# Altium schematic sheet ETH_microSD.SchDoc
size B; Organization: Altium Limited; Address1: L3, 12a Rodborough Rd; Address2: Frenchs Forest; Address3: NSW; Address4: Australia 2086
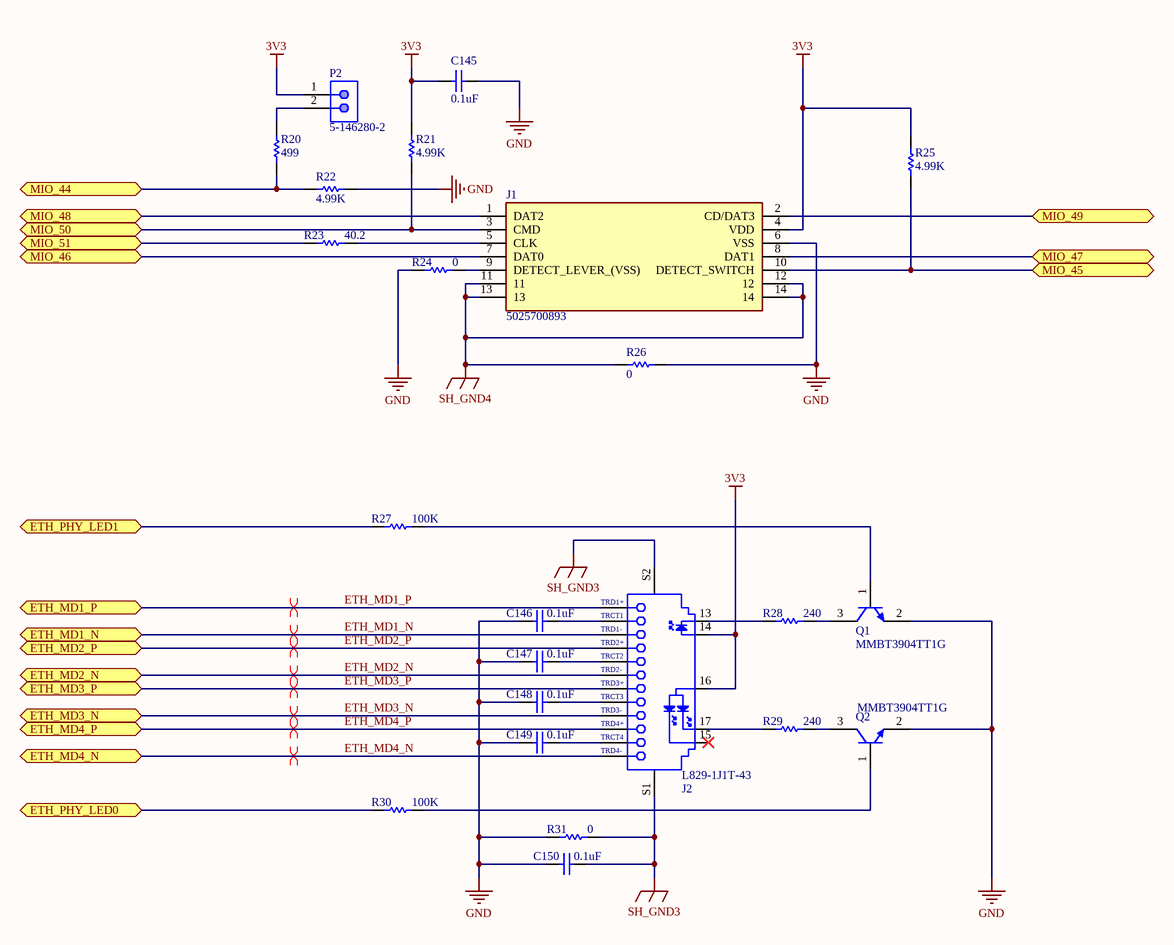
[diagram p0: ETH_microSD.SchDoc]

## Parts
C145  0.1uF  [CAPC0201(0603)33_N]
C146  0.1uF  [CAPC0201(0603)33_N]
C147  0.1uF  [CAPC0201(0603)33_N]
C148  0.1uF  [CAPC0201(0603)33_N]
C149  0.1uF  [CAPC0201(0603)33_N]
C150  0.1uF  [CAPC0201(0603)33_N]
J1  5025700893  [5025700893]
J2  L829-1J1T-43  [BELS-L829-1J1T-43_V]
P2  5-146280-2  [TECO-5-146280-2_V]
Q1  MMBT3904TT1G  [ONSC-SC-75-3-463-01_V]
Q2  MMBT3904TT1G  [ONSC-SC-75-3-463-01_V]
R20  499  [RESC0402(1005)_N]
R21  4.99K  [RESC0402(1005)_N]
R22  4.99K  [RESC0402(1005)_N]
R23  40.2  [RESC0402(1005)_N]
R24  0  [RESC0402(1005)_N]
R25  4.99K  [RESC0402(1005)_N]
R26  0  [RESC0402(1005)_N]
R27  100K  [RESC0402(1005)_N]
R28  240  [RESC0402(1005)_N]
R29  240  [RESC0402(1005)_N]
R30  100K  [RESC0402(1005)_N]
R31  0  [RESC0402(1005)_N]

## Ports
ETH_MD1_N (bidir), ETH_MD1_P (bidir), ETH_MD2_N (bidir), ETH_MD2_P (bidir), ETH_MD3_N (bidir), ETH_MD3_P (bidir), ETH_MD4_N (bidir), ETH_MD4_P (bidir), ETH_PHY_LED0 (bidir), ETH_PHY_LED1 (bidir), MIO_44 (bidir), MIO_45 (bidir), MIO_46 (bidir), MIO_47 (bidir), MIO_48 (bidir), MIO_49 (bidir), MIO_50 (bidir), MIO_51 (bidir)

## Nets
3V3: C145.1 J1.4(VDD) J2.14 J2.16 P2.1 R21.2 R25.2
GND: C145.2 C146.1 C147.1 C148.1 C149.1 C150.1 J1.6(VSS) Q1.2(E) Q2.2(E) R22.2 R24.1 R26.2 R31.1
SH_GND3: C150.2 J2.S1 J2.S2 R31.2
SH_GND4: J1.11 J1.12 J1.13 J1.14 R26.1
ETH_MD1_N: J2.3(TRD1-) ; port ETH_MD1_N
ETH_MD1_P: J2.1(TRD1+) ; port ETH_MD1_P
ETH_MD2_N: J2.6(TRD2-) ; port ETH_MD2_N
ETH_MD2_P: J2.4(TRD2+) ; port ETH_MD2_P
ETH_MD3_N: J2.9(TRD3-) ; port ETH_MD3_N
ETH_MD3_P: J2.7(TRD3+) ; port ETH_MD3_P
ETH_MD4_N: J2.12(TRD4-) ; port ETH_MD4_N
ETH_MD4_P: J2.10(TRD4+) ; port ETH_MD4_P
ETH_PHY_LED0: R30.1 ; port ETH_PHY_LED0
ETH_PHY_LED1: R27.1 ; port ETH_PHY_LED1
MIO_44: R20.1 R22.1 ; port MIO_44
MIO_45: J1.10(DETECT_SWITCH) R25.1 ; port MIO_45
MIO_46: J1.7(DAT0) ; port MIO_46
MIO_47: J1.8(DAT1) ; port MIO_47
MIO_48: J1.1(DAT2) ; port MIO_48
MIO_49: J1.2(CD/DAT3) ; port MIO_49
MIO_50: J1.3(CMD) R21.1 ; port MIO_50
MIO_51: R23.1 ; port MIO_51
NetC146_2: C146.2 J2.2(TRCT1)
NetC147_2: C147.2 J2.5(TRCT2)
NetC148_2: C148.2 J2.8(TRCT3)
NetC149_2: C149.2 J2.11(TRCT4)
NetJ1_5: J1.5(CLK) R23.2
NetJ1_9: J1.9(DETECT_LEVER_(VSS)) R24.2
NetJ2_13: J2.13 R28.1
NetJ2_17: J2.17 R29.1
NetP2_2: P2.2 R20.2
NetQ1_1: Q1.1(B) R27.2
NetQ1_3: Q1.3(C) R28.2
NetQ2_1: Q2.1(B) R30.2
NetQ2_3: Q2.3(C) R29.2

Not connected (* = marked no-connect by the designer): J2 15*

## Layout directives
differential pair: ETH_MD1_N, ETH_MD1_P, ETH_MD2_N, ETH_MD2_P, ETH_MD3_N, ETH_MD3_P, ETH_MD4_N, ETH_MD4_P

## Notes on the sheet
- Title
- Size:
- Date:
- B
- Number:
- Time:
- Revision:
- Sheet
- of
- File:

## Library data of the parts
C145-C150 = CAP_0201
J1 = 5025700893: Connector; Manufacturer_Name: Molex; Datasheet Link: https://www.molex.com/pdm_docs/sd/5025700893_sd.pdf; Height: 1mm; Manufacturer_Part_Number: 5025700893
J2 = CMP-1715-00001-1: Gigabit MagJack(R) Ultra Low Profile, 10/100/1000 Base-T, 19-Pin THD, RoHS, Tray; Width: 24.13 mm; RoHSCompliant: True; PartNumber: L829-1J1T-43; Case/Package: Metal; Mount: Through Hole; ComponentLink1Description: Manufacturer URL; Height: 11.3 mm; Package Quantity: 60; Packaging: Tray; Length: 17.78 mm; PackageDescription: 19-Pin Through Hole Device, Body 23.94 x 17.58 mm, Pitch 2.03 mm; ComponentLink2URL: http://belfuse.com/pdfs/L829-1J1T-43.pdf; ComponentLink1URL: http://belfuse.com/ethernet/; Mounting Technology: Through Hole; DatasheetVersion: Rev. G; Pins: 8; ComponentLink2Description: Datasheet
P2 = CMP-2000-07492-1: Male Header, Pitch 2.54 mm, 1 x 2 Position, Height 8.21 mm, Tail Length 3.05 mm, -65 to 105 degC, RoHS, Bulk; Manufacturer: TE Connectivity; Mating Connector Lock: No(Without); Number of Positions: 2; Pitch: 2.54mm; PCB Mounting Orientation: Vertical; Keyed: No; Case\/Package: 100; Mating Post Length: 0.23inch; High Temperature Housing: Yes; Max Current Rating: 5A; PCB Thickness: 0.063inch; PCB Mount Retention: Without; Approvals: CSA; Current Rating: 3A; Radiation Hardening: No; Length: 4.67mm; Contact Mating Length: 0.23inch; Connector Type: Header; Number of Rows: 1; Termination Post Length: 0.12inch; Board Standoff: No(Without); Max Operating Temperature: 105degC; Contact Shape: Square; Selectively Loaded: No(Without); Gasket: No(Without); Number of Contacts: 2; Contact Gender: Male; Mating Alignment: No(Without); Manufacturer URL: http://www.te.com/; Datasheet URL: http://www.te.com/commerce/DocumentDelivery/DDEController?Action=showdoc&DocId=Customer+Drawing%7F146280%7FH1%7Fpdf%7FEnglish%7FENG_CD_146280_H1.pdf%7F5-146280-2; Mount: ThroughHole; Orientation: Straight; Packaging: Carton; Package Reference: 5-146280-2; Package Quantity: 500; Stabilizers: No(Without); Row Spacing: 2.54mm; Contact Material: CopperAlloy; Panel Mount Retention: No(Without); Datasheet Version: Rev. H1, 08/2016; Housing Colour: Black; Colour: Black; Package Description: Male Header, Pitch 2.54 mm, 1 x 2 Position, Height 8.21 mm, Tail Length 3.05 mm; Contact Plating: Matte; Housing Material: Polymer; Contact Protection: No(Without); Min Operating Temperature: -65degC; Mounting Technology: ThroughHole; Flammability Rating: UL94V-0; RoHSCompliant: true; Termination: ThroughHole; Depth: 2.34mm; High Speed Serial Data Connector: No
Q1 Q2 = CMP-1048-00420-1: General Purpose Transistor, NPN Silicon, 3-Pin SC-75, Pb-Free, Tape and Reel; Manufacturer: On Semiconductor; IC Continuous (A): 0.2; fT Min (MHz): 300; ComponentLink3URL: http://www.onsemi.com/pub_link/Collateral/463-01.PDF; DatasheetVersion: Rev. 5; RoHS: TRUE; Mounting Technology: Surface Mount; ComponentLink1URL: http://www.onsemi.com/; ComponentLink3Description: Package Specification; PackageReference: SC-75-3-463-01; Polarity: NPN; ComponentLink2Description: Datasheet; PackageVersion: Rev. F, 07/2005; PartNumber: MMBT3904TT1G; ComponentLink2URL: http://www.onsemi.cn/pub_link/Collateral/MMBT3904TT1-D.PDF; ComponentLink1Description: Manufacturer URL; PackageDescription: 3-Pin Small Outline Transistor, Body 1.6 x 0.8 mm, Pitch 0.5 mm; Packing: Tape and Reel
R20-R31 = RES_0402